# Altium schematic sheet DC.SchDoc
size A4
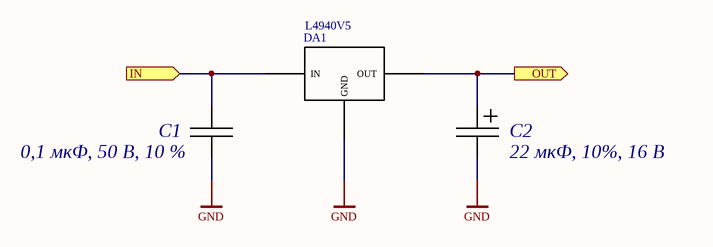
[diagram p0: DC.SchDoc]

## Parts
C1  0,1 мкФ, 50 В, 10 %  [CAP: 0805]
C2  22 мкФ, 10%, 16 В  [CAP: TANTAL-C]
DA1  L4940V5  [TO220_L]

## Ports
IN (in), OUT (out)

## Nets
GND: C1.1 C2.2 DA1.2(GND)
IN: C1.2 DA1.1(IN) ; port IN
OUT: C2.1 DA1.3(OUT) ; port OUT

## Library data of the parts
C1 = GRM21BR71H104K: Конденсатор; Manufacturer: Murata Manufacturing; ValueOther: Value; ID: 19; ChipDip: #https://www.chipdip.ru/product/grm21br71h104k#; ElementName: Кер.ЧИП конд. 0.1 мкФ X7R 50В 10% 0805, GRM21BR71H104K**; ValueSCH: 0,1 мкФ, 50 В, 10 %; Partnumber: GRM21BR71H104K; HelpURL: https://static.chipdip.ru/lib/235/DOC000235066.pdf; Temperature Min: -55; Temperature Max: +125; weight: 0,04; price: 7*10; last_update: 21.11.2020
C2 = TECAP22/16VC10: Конденсатор; Manufacturer: Китай; ID: 35; ChipDip: #https://www.chipdip.ru/product/tecap-22-mkf-16-v-tip-c-10#; ElementName: Конденсатор танталовый SMD, TECAP, 22 мкФ, 16 В, тип C, 10%; Partnumber: TECAP22/16VC10; Temperature Min: -55; Temperature Max: +125; weight: 0,15; price: 44; ValueSCH: 22 мкФ, 10%, 16 В; last_update: 12.10.2023
DA1 = L4940V5_L: LDO регуляторы напряжения 5.0V 1.5A Positive; Manufacturer: STMicroelectronics; ID: 8; ElementName: Линейный стабилизатор напряжения, +5В, 1.5 А, LDO; URL_bying: #https://www.chipdip.ru/product/l4940v5#; Partnumber: L4940V5_L; ValueSCH: L4940V5; Temperature Min: -40; Temperature Max: +150; weight: 2,5; ChipDip: #https://www.chipdip.ru/product/l4940v5#; price: 200; last_update: 12.10.2023